# Altium schematic sheet FPGA_CONFIG.SchDoc
size 393 x 281 mm; PageSetup: Record=PageOptions|CenterHorizontal=True|CenterVertical=True|PrintScale=0.94|XCorrection=0.00|YCorrection=0.00|PrintKind=0|BorderSize=5000000|LeftOffset=0|BottomOffset=0|Orientation=2|PaperLength=1000|PaperWidth=1000|Scale=100|PaperSource=15|PrintQuality=600|MediaType=1|DitherType=10|PrintScaleMode=1|PaperKind=A4; Adr1: August Barks gata 6B; Adr2: SE-421 32 Västra Frölunda; Adr3: Sweden; Webpage: www.omnisys.se
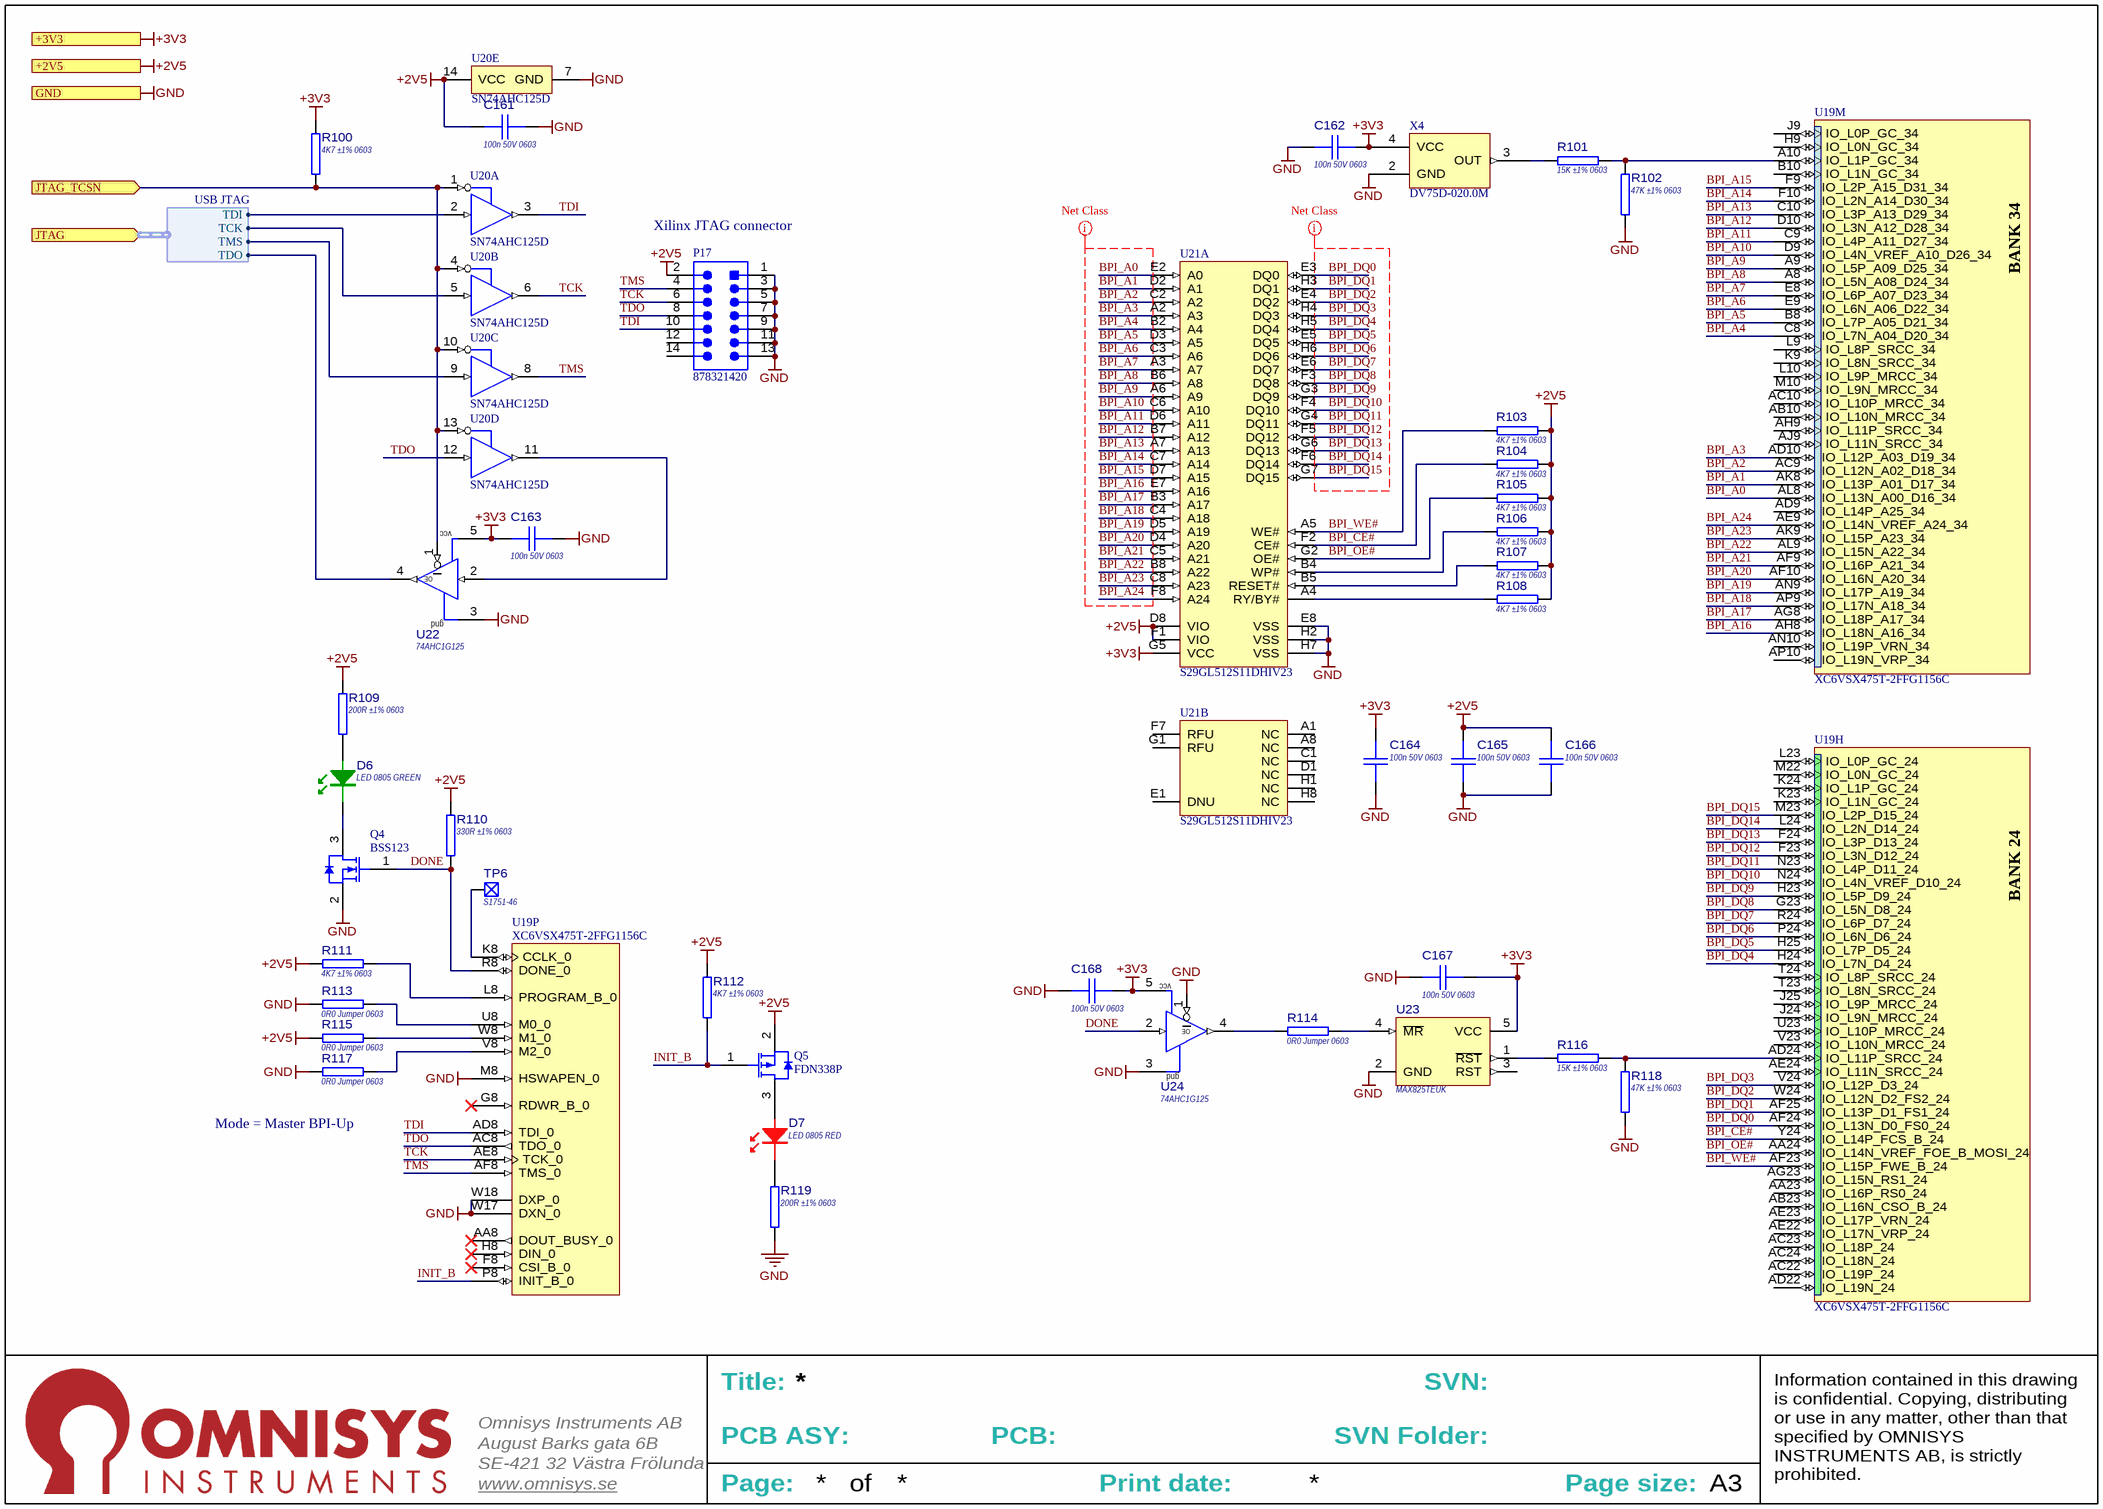
[diagram p0: FPGA_CONFIG.SchDoc]

## Parts
C161  100n 50V 0603  [CAPC1608X90N]
C162  100n 50V 0603  [CAPC1608X90N]
C163  100n 50V 0603  [CAPC1608X90N]
C164  100n 50V 0603  [CAPC1608X90N]
C165  100n 50V 0603  [CAPC1608X90N]
C166  100n 50V 0603  [CAPC1608X90N]
C167  100n 50V 0603  [CAPC1608X90N]
C168  100n 50V 0603  [CAPC1608X90N]
D6  LED 0805 GREEN  [LED2012-GREEN]
D7  LED 0805 RED  [LED2012-RED]
P17  878321420  [MOLX-878321420_V]
Q4  BSS123  [FAIR-SOT23-3_V]
Q5  FDN338P  [FAIR-SSOT3L-3_V]
R100  4K7 ±1% 0603  [RESC1608N]
R101  15K ±1% 0603  [RESC1608N]
R102  47K ±1% 0603  [RESC1608N]
R103  4K7 ±1% 0603  [RESC1608N]
R104  4K7 ±1% 0603  [RESC1608N]
R105  4K7 ±1% 0603  [RESC1608N]
R106  4K7 ±1% 0603  [RESC1608N]
R107  4K7 ±1% 0603  [RESC1608N]
R108  4K7 ±1% 0603  [RESC1608N]
R109  200R ±1% 0603  [RESC1608N]
R110  330R ±1% 0603  [RESC1608N]
R111  4K7 ±1% 0603  [RESC1608N]
R112  4K7 ±1% 0603  [RESC1608N]
R113  0R0 Jumper 0603  [RESC1608N]
R114  0R0 Jumper 0603  [RESC1608N]
R115  0R0 Jumper 0603  [RESC1608N]
R116  15K ±1% 0603  [RESC1608N]
R117  0R0 Jumper 0603  [RESC1608N]
R118  47K ±1% 0603  [RESC1608N]
R119  200R ±1% 0603  [RESC1608N]
TP6  S1751-46  [S1751-46]
U19  XC6VSX475T-2FFG1156C  [FFG1156]  (parts H,M,P of 20)
U20  SN74AHC125D  [SOIC127P600X175-14N]  (parts A,B,C,D,E of 5)
U21  S29GL512S11DHIV23  [BGA64C100P8X8_900X900X140]  (parts A,B of 2)
U22  74AHC1G125  [SOT95P280X100-5N]
U23  MAX825TEUK  [SOT95P280X100-5N]
U24  74AHC1G125  [SOT95P280X100-5N]
X4  DV75D-020.0M  [SON127P420X200-4N]

## Ports
+2V5, +3V3, GND, JTAG (in, harness USB JTAG), JTAG_TCSN (in)

## Harnesses
USB JTAG: TCK, TDI, TDO, TMS

## Nets
+2V5: C161.1 C165.1 C166.1 P17.2 Q5.2(SOURCE) R103.1 R104.1 R105.1 R106.1 R107.1 R108.1 R109.2 R110.1 R111.2 R112.1 R115.1 U20.14(VCC) U21.D8(VIO) U21.F1(VIO) ; port +2V5
+3V3: C162.1 C163.1 C164.1 C167.2 C168.1 R100.2 U21.G5(VCC) U22.5(VCC) U23.5(VCC) U24.5(VCC) X4.4(VCC) ; port +3V3
GND: C161.2 C162.2 C163.2 C164.2 C165.2 C166.2 C167.1 C168.2 P17.1 P17.3 P17.5 P17.7 P17.9 P17.11 P17.13 Q4.2(S) R102.1 R113.1 R117.1 R118.1 R119.1 U19.M8(HSWAPEN_0) U19.W17(DXN_0) U19.W18(DXP_0) U20.7(GND) U21.E8(VSS) U21.H2(VSS) U21.H7(VSS) U22.3(GND) U23.2(GND) U24.1(~{O}E) U24.3(GND) X4.2(GND) ; port GND
BPI_A0: U19.AL8(IO_L13N_A00_D16_34) U21.E2(A0)
BPI_A1: U19.AK8(IO_L13P_A01_D17_34) U21.D2(A1)
BPI_A2: U19.AC9(IO_L12N_A02_D18_34) U21.C2(A2)
BPI_A3: U19.AD10(IO_L12P_A03_D19_34) U21.A2(A3)
BPI_A4: U19.C8(IO_L7N_A04_D20_34) U21.B2(A4)
BPI_A5: U19.B8(IO_L7P_A05_D21_34) U21.D3(A5)
BPI_A6: U19.E9(IO_L6N_A06_D22_34) U21.C3(A6)
BPI_A7: U19.E8(IO_L6P_A07_D23_34) U21.A3(A7)
BPI_A8: U19.A8(IO_L5N_A08_D24_34) U21.B6(A8)
BPI_A9: U19.A9(IO_L5P_A09_D25_34) U21.A6(A9)
BPI_A10: U19.D9(IO_L4N_VREF_A10_D26_34) U21.C6(A10)
BPI_A11: U19.C9(IO_L4P_A11_D27_34) U21.D6(A11)
BPI_A12: U19.D10(IO_L3N_A12_D28_34) U21.B7(A12)
BPI_A13: U19.C10(IO_L3P_A13_D29_34) U21.A7(A13)
BPI_A14: U19.F10(IO_L2N_A14_D30_34) U21.C7(A14)
BPI_A15: U19.F9(IO_L2P_A15_D31_34) U21.D7(A15)
BPI_A16: U19.AH8(IO_L18N_A16_34) U21.E7(A16)
BPI_A17: U19.AG8(IO_L18P_A17_34) U21.B3(A17)
BPI_A18: U19.AP9(IO_L17N_A18_34) U21.C4(A18)
BPI_A19: U19.AN9(IO_L17P_A19_34) U21.D5(A19)
BPI_A20: U19.AF10(IO_L16N_A20_34) U21.D4(A20)
BPI_A21: U19.AF9(IO_L16P_A21_34) U21.C5(A21)
BPI_A22: U19.AL9(IO_L15N_A22_34) U21.B8(A22)
BPI_A23: U19.AK9(IO_L15P_A23_34) U21.C8(A23)
BPI_A24: U19.AE9(IO_L14N_VREF_A24_34) U21.F8(A24)
BPI_CE#: R104.2 U19.Y24(IO_L14P_FCS_B_24) U21.F2(CE#)
BPI_DQ0: U19.AF24(IO_L13N_D0_FS0_24) U21.E3(DQ0)
BPI_DQ1: U19.AF25(IO_L13P_D1_FS1_24) U21.H3(DQ1)
BPI_DQ2: U19.W24(IO_L12N_D2_FS2_24) U21.E4(DQ2)
BPI_DQ3: U19.V24(IO_L12P_D3_24) U21.H4(DQ3)
BPI_DQ4: U19.H24(IO_L7N_D4_24) U21.H5(DQ4)
BPI_DQ5: U19.H25(IO_L7P_D5_24) U21.E5(DQ5)
BPI_DQ6: U19.P24(IO_L6N_D6_24) U21.H6(DQ6)
BPI_DQ7: U19.R24(IO_L6P_D7_24) U21.E6(DQ7)
BPI_DQ8: U19.G23(IO_L5N_D8_24) U21.F3(DQ8)
BPI_DQ9: U19.H23(IO_L5P_D9_24) U21.G3(DQ9)
BPI_DQ10: U19.N24(IO_L4N_VREF_D10_24) U21.F4(DQ10)
BPI_DQ11: U19.N23(IO_L4P_D11_24) U21.G4(DQ11)
BPI_DQ12: U19.F23(IO_L3N_D12_24) U21.F5(DQ12)
BPI_DQ13: U19.F24(IO_L3P_D13_24) U21.G6(DQ13)
BPI_DQ14: U19.L24(IO_L2N_D14_24) U21.F6(DQ14)
BPI_DQ15: U19.M23(IO_L2P_D15_24) U21.G7(DQ15)
BPI_OE#: R105.2 U19.AA24(IO_L14N_VREF_FOE_B_MOSI_24) U21.G2(OE#)
BPI_WE#: R103.2 U19.AF23(IO_L15P_FWE_B_24) U21.A5(WE#)
DONE: Q4.1(G) R110.2 U19.R8(DONE_0) U24.2(B)
INIT_B: Q5.1(GATE) R112.2 U19.P8(INIT_B_0)
JTAG_TCSN: R100.1 U20.1(1OE#) U20.4(2OE#) U20.10(3OE#) U20.13(4OE#) U22.1(~{O}E) ; port JTAG_TCSN
TCK: P17.6 U19.AE8(TCK_0) U20.6(2Y)
TDI: P17.10 U19.AD8(TDI_0) U20.3(1Y)
TDO: P17.8 U19.AC8(TDO_0) U20.12(4A)
TMS: P17.4 U19.AF8(TMS_0) U20.8(3Y)
NetD6_1: D6.1 Q4.3(D)
NetD6_2: D6.2 R109.1
NetD7_1: D7.1 R119.2
NetD7_2: D7.2 Q5.3(DRAIN)
NetR101_1: R101.1 X4.3(OUT)
NetR101_2: R101.2 R102.2 U19.A10(IO_L1P_GC_34)
NetR106_2: R106.2 U21.B4(WP#)
NetR107_2: R107.2 U21.B5(RESET#)
NetR108_2: R108.2 U21.A4(RY/BY#)
NetR111_1: R111.1 U19.L8(PROGRAM_B_0)
NetR113_2: R113.2 U19.U8(M0_0)
NetR114_1: R114.1 U23.4(~{MR})
NetR114_2: R114.2 U24.4(Y)
NetR115_2: R115.2 U19.W8(M1_0)
NetR116_1: R116.1 U23.1(~{RST})
NetR116_2: R116.2 R118.2 U19.AD24(IO_L11P_SRCC_24)
NetR117_2: R117.2 U19.V8(M2_0)
NetTP6_1: TP6.1 U19.K8(CCLK_0)
NetU20_2: U20.2(1A) ; port JTAG.TDI
NetU20_5: U20.5(2A) ; port JTAG.TCK
NetU20_9: U20.9(3A) ; port JTAG.TMS
NetU20_11: U20.11(4Y) U22.2(B)
NetU22_4: U22.4(Y) ; port JTAG.TDO

Not connected (* = marked no-connect by the designer): P17 12 14; U19 AA8(DOUT_BUSY_0)* AA23(IO_L16P_RS0_24) AB10(IO_L10N_MRCC_34) AB23(IO_L16N_CSO_B_24) AC10(IO_L10P_MRCC_34) AC22(IO_L19P_24) AC23(IO_L18P_24) AC24(IO_L18N_24) AD9(IO_L14P_A25_34) AD22(IO_L19N_24) AE22(IO_L17N_VRP_24) AE23(IO_L17P_VRN_24) AE24(IO_L11N_SRCC_24) AG23(IO_L15N_RS1_24) AH9(IO_L11P_SRCC_34) AJ9(IO_L11N_SRCC_34) AN10(IO_L19P_VRN_34) AP10(IO_L19N_VRP_34) B10(IO_L1N_GC_34) F8(CSI_B_0)* G8(RDWR_B_0)* H8(DIN_0)* H9(IO_L0N_GC_34) J9(IO_L0P_GC_34) J24(IO_L9N_MRCC_24) J25(IO_L9P_MRCC_24) K9(IO_L8N_SRCC_34) K23(IO_L1N_GC_24) K24(IO_L1P_GC_24) L9(IO_L8P_SRCC_34) L10(IO_L9P_MRCC_34) L23(IO_L0P_GC_24) M10(IO_L9N_MRCC_34) M22(IO_L0N_GC_24) T23(IO_L8N_SRCC_24) T24(IO_L8P_SRCC_24) U23(IO_L10P_MRCC_24) V23(IO_L10N_MRCC_24); U21 A1(NC) A8(NC) C1(NC) D1(NC) E1(DNU) F7(RFU) G1(RFU) H1(NC) H8(NC); U23 3(RST)

## Layout directives
net class Match_length_BPI_flash; rule Matched Net Lengths [Tolerance = 10mm]: BPI_A0, BPI_A1, BPI_A2, BPI_A3, BPI_A4, BPI_A5, BPI_A6, BPI_A7, BPI_A8, BPI_A9, BPI_A10, BPI_A11, BPI_A12, BPI_A13, BPI_A14, BPI_A15, BPI_A16, BPI_A17, BPI_A18, BPI_A19, BPI_A20, BPI_A21, BPI_A22, BPI_A23, BPI_A24, BPI_DQ0, BPI_DQ1, BPI_DQ2, BPI_DQ3, BPI_DQ4, BPI_DQ5, BPI_DQ6, BPI_DQ7, BPI_DQ8, BPI_DQ9, BPI_DQ10, BPI_DQ11, BPI_DQ12, BPI_DQ13, BPI_DQ14, BPI_DQ15

## Notes on the sheet
- (near P17) Xilinx JTAG connector
- (near R117) Mode = Master BPI-Up
- Title:
- SVN:
- August Barks gata 6B
- SE-421 32 Västra Frölunda
- Omnisys Instruments AB
- PCB ASY:
- PCB:
- SVN Folder:
- www.omnisys.se
- Page:
- of
- Print date:
- Page size:
- A3
- Information contained in this drawing is confidential. Copying, distributing or use in any matter, other than that specified by OMNISYS INSTRUMENTS AB, is strictly prohibited.
- (in symbol CMP-0083-00172-1, part H) BANK 24
- (in symbol CMP-0083-00172-1, part M) BANK 34
- (in symbol CMP-2100-000126-1) vcc; OE; gnd

## Library data of the parts
C161-C168 = CMP-0300-002665-2: 100n 50V X7R ±10% 0603 (1608 metric); PartNumber: GRM188R71H104KA93; Rated voltage (V): 50; Capacitance (F): 100.0n; Package: 1608/0603; Temperature Charateristics: X7R; Thickness (mm): 0.90; Tolerance: ±10%
D6 = CMP-1500-000004-2
D7 = CMP-1500-000001-2
P17 = CMP-2000-05520-1: Male Header, Pitch 2 mm, 2 x 7 Position, Height 7.6 mm, -55 to 105 degC, RoHS; Manufacturer: Molex; Datasheet URL: http://www.molex.com/pdm_docs/sd/878321420_sd.pdf; Package Description: Male Header, Pitch 2 mm, 2 x 7 Positions, Height 7.6 mm; Manufacturer URL: http://www.molex.com/; Package Reference: 878321420; Datasheet Version: Rev. G, 01/2012; Mounting Technology: SurfaceMount
Q4 = CMP-2000-04934-1: N-Channel Logic Level Enhancement Mode Field Effect Transistor, 1.7 V, -55 to 150 degC, 3-Pin SOT-23, RoHS, Tape and Reel; Manufacturer: Fairchild; Channel Type: N; Typical Turn-Off Delay Time: 17ns; Maximum Continuous Drain Current: 0.17A; Rad Hard: No; Typical Rise Time: 9ns; Typical Fall Time: 2.4ns; Maximum Gate Source Voltage: ±20V; Maximum Drain Source Voltage: 100V; Typical Turn-On Delay Time: 1.7ns; RDS-on: 6000@10VmOhm; Package Version: Rev. 12, 03/2016; Packaging: Tape&Reel; Package Reference: SOT23-3; Channel Mode: Enhancement; Operating Temperature: -55to150degC; Package Description: 3-Pin Small Outline Transistor, Body 2.92 x 1.325 mm, Pitch 0.95 mm; Category: MOSFET; Datasheet Version: Jun-03; Datasheet URL: https://www.fairchildsemi.com/datasheets/BS/BSS123.pdf; Manufacturer URL: https://www.fairchildsemi.com/; Mounting: SurfaceMount; Package: 3SOT-23; Package URL: http://www.fairchildsemi.com/dwg/MA/MA03D.pdf
Q5 = CMP-2000-06251-1: P-Channel Specified Power Trench(R) MOSFET, 2.5 V, -20 V, -1.6 A, -55 to 150 degC, 3-Pin SOT23, RoHS, Tape and Reel; Manufacturer: Fairchild Semiconductor; Current - Continuous Drain (Id) @ 25°C: 1.6A(Ta); Product Training Modules: HighVoltageSwitchesforPowerProcessingSMPSPowerSwitch; Gate Charge (Qg) @ Vgs: 6.2nC@4.5V; Package Version: Rev. 3, 05/2015; PCN Design/Specification: MoldCompound08/April/2008; Vgs(th) (Max) @ Id: 1.5V@250µA; FET Type: MOSFETP-Channel,MetalOxide; FET Feature: Standard; PCN Packaging: BinaryYearCodeMarking15/Jan/2014; Other Names: FDN338PTR; Online Catalog: P-ChannelLogicLevelGateFETs; Input Capacitance (Ciss) @ Vds: 451pF@10V; Rds On (Max) @ Id, Vgs: 115mOhm@1.6A,4.5V; Drain to Source Voltage (Vdss): 20V; Power - Max: 460mW; Datasheet Version: Rev. F1(W), 11/2013; Manufacturer URL: https://www.fairchildsemi.com/; Package Description: 3-Pin Small Outline Transistor, Body 2.92 x 1.4 mm, Pitch 0.95 mm; Datasheet URL: https://datasheet.ciiva.com/22655/1802191-22655335.pdf; Family: FETs-Single; Package URL: https://www.fairchildsemi.com/package-drawings/MA/MA03B.pdf; Package Reference: SSOT3L; Supplier Device Package: 3-SSOT; Standard Package: 3,000; Package / Case: TO-236-3,SC-59,SOT-23-3; Mounting Technology: SurfaceMount; Series: PowerTrench®; Mounting Type: SurfaceMount; Packaging: Tape&Reel(TR); Category: DiscreteSemiconductorProducts
R100 R103-R108 R111 R112 = CMP-1800-002037-3: 4K7 ±1% ±100 ppm/˚C 0.10W 75V 0603 (1608 metric); Value: 4.7k; Power: 100mW; Case-EIA: 0603; Case-Metric: 1608; Temp. Coefficent: 0.01%; Maximum working voltage: 75V; Tolerance: 1%; Technology: SMT
R101 R116 = CMP-1800-002049-3: 15K ±1% ±100 ppm/˚C 0.10W 75V 0603 (1608 metric); Power: 100mW; Case-EIA: 0603; Case-Metric: 1608; Temp. Coefficent: 0.01%; Value: 15k; Maximum working voltage: 75V; Tolerance: 1%; Technology: SMT
R102 R118 = CMP-1800-002061-3: 47K ±1% ±100 ppm/˚C 0.10W 75V 0603 (1608 metric); Power: 100mW; Case-EIA: 0603; Case-Metric: 1608; Temp. Coefficent: 0.01%; Value: 47k; Maximum working voltage: 75V; Tolerance: 1%; Technology: SMT
R109 R119 = CMP-1800-002005-3: 200R ±1% ±100 ppm/˚C 0.10W 75V 0603 (1608 metric); Value: 200; Power: 100mW; Case-EIA: 0603; Case-Metric: 1608; Temp. Coefficent: 0.01%; Maximum working voltage: 75V; Tolerance: 1%; Technology: SMT
R110 = CMP-1800-002010-3: 330R ±1% ±100 ppm/˚C 0.10W 75V 0603 (1608 metric); Value: 330; Power: 100mW; Case-EIA: 0603; Case-Metric: 1608; Temp. Coefficent: 0.01%; Maximum working voltage: 75V; Tolerance: 1%; Technology: SMT
R113-R115 R117 = CMP-1800-001949-3: 0R0 Jumper 75V 0603 (1608 metric) Max 2.0A; Value: 0; Tolerance: 0%; Power: 0W; Case-EIA: 0603; Case-Metric: 1608; Temp. Coefficent: 0%; Maximum working voltage: 75V; Technology: SMT
TP6 = CMP-3600-000004-1: SMD Test point clip; PartNumber: S1751-46
U19 = CMP-0083-00172-1: Virtex-6 SXT Platform FPGA, 600 User I/Os, 20 GTXs, 1156-Ball FFBGA, Speed Grade 2, Commercial Grade, Pb-Free; Code_JEDEC: MS-034-AAR-1; PackageReference: FFG1156; Code_IPC: BGA100P34X34-1156; PackageDescription: 1156-Ball Flip-Chip Fine Pitch Ball Grid Array (FFG1156) - Pb-Free; PackageVersion: ver1.0, Jan-2010; DatasheetVersion: ver2.2, Jan-2010; PartId: 1
U20 = CMP-2100-000562-2: Buffer/Line Driver 4-CH Non-Inverting 3-ST CMOS 14-Pin SOIC Tube; Number of Bits: 4; Min Supply Voltage: 2V; Propagation Delay: 15ns; High Level Output Current: -8mA; Quiescent Current: 4uA; Number of Bits per Element: 1; Max Supply Voltage: 5.5V; Logic Function: Buffer,Inverting; Turn-On Delay Time: 11.5ns; Low Level Output Current: 8mA; REACH SVHC: No SVHC; Max Operating Temperature: 125°C; Polarity: Non-Inverting; Case/Package: SOIC; Number of Elements: 4; Package Quantity: 50; Number of Output Lines: 4; Min Operating Temperature: -40°C; Length: 8.65mm; Mount: Surface Mount; Number of Channels: 4; Number of Pins: 14; Termination: SMD/SMT; Number of Inputs: 4; Radiation Hardening: No; Lead Free: Lead Free; Height: 1.58mm; Number of Input Lines: 4; Packaging: Rail/Tube; Width: 3.91mm; Number of Outputs: 4; PartId: 1
U21 = CMP-2100-000561-1: IC FLASH MEM 512MBIT PAGE 64BGA; Interface: Parallel; Memory Type: FLASH,NOR; Case/Package: FBGA; PartNumber: S29GL512S11DHIV23; Packaging: Tape and Reel; Min Operating Temperature: -40°C; Max Operating Temperature: 85°C; Number of Pins: 64
U22 U24 = CMP-2100-000126-1: Single bus buffer gate with 3-state output
U23 = CMP-2100-000175-1: Microprocessor Supervisory Circuits With Watchdog Timer and Manual Reset SOT-23-5, reset th: 3.08V
X4 = CMP-00001-1: OSC TCXO 20.000MHZ LVCMOS SMD; Max Supply Current: 6mA; Frequency: 20MHz; Frequency Stability: 1ppm; Package Quantity: 250; Min Operating Temperature: -40°C; Packaging: Tape and Reel; Max Operating Temperature: 85°C; Case/Package: SMD/SMT